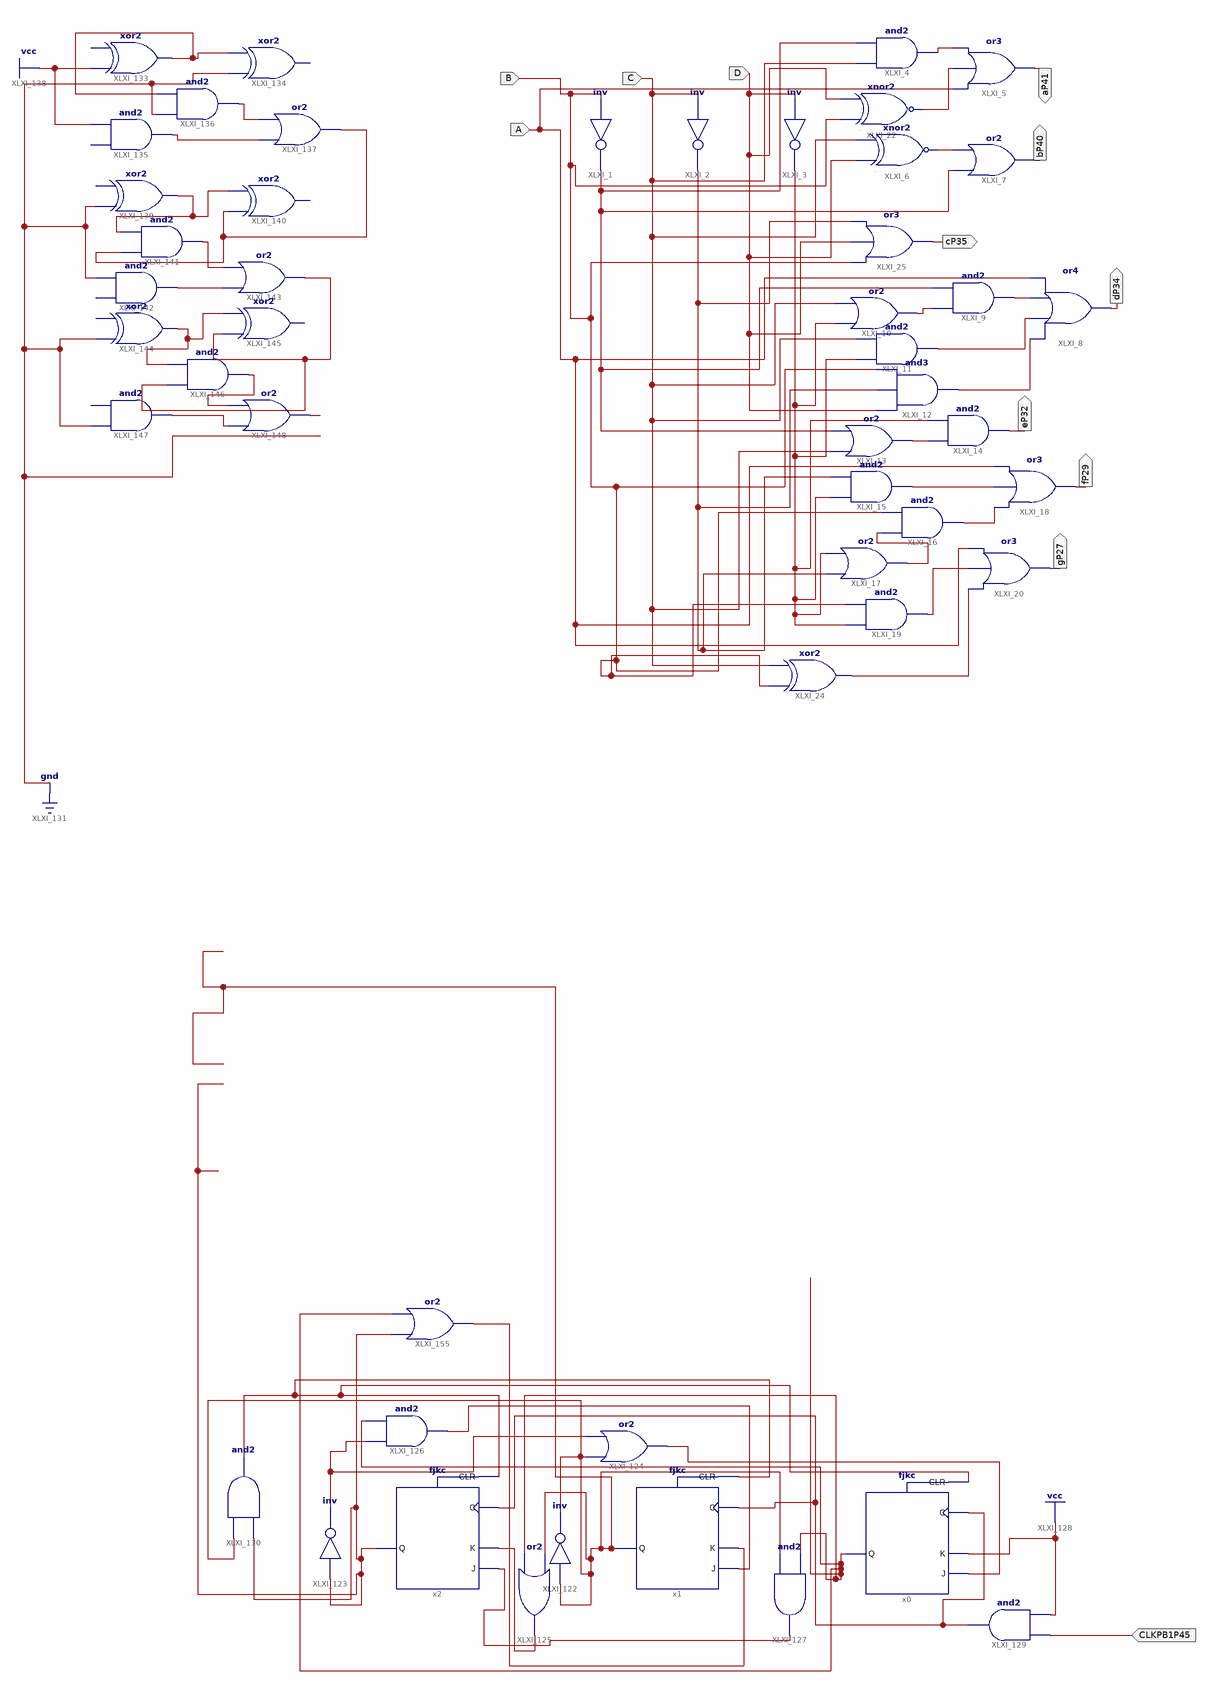
[diagram p0: schematic sheet 1]
// Xilinx ISE schematic lab52sch.sch (spartan6) as structural Verilog: 50 symbols, 12 ports
module lab52sch (
  input  C,
  input  D,
  input  B,
  input  A,
  input  CLKPB1P45,
  output aP41,
  output bP40,
  output cP35,
  output dP34,
  output eP32,
  output fP29,
  output gP27
);

  wire XLXN_4, XLXN_7, XLXN_9, XLXN_13, XLXN_16, XLXN_17, XLXN_21, XLXN_27, XLXN_29, XLXN_36, XLXN_42,
       XLXN_45, XLXN_46, XLXN_49, XLXN_52, XLXN_55, XLXN_238, XLXN_240, XLXN_242, XLXN_248, XLXN_251,
       XLXN_254, XLXN_260, XLXN_266, XLXN_267, XLXN_270, XLXN_274, XLXN_275, XLXN_276, XLXN_278, XLXN_306,
       XLXN_307, XLXN_308, XLXN_309, XLXN_323, XLXN_333, XLXN_334, XLXN_335, XLXN_341;

  not XLXI_1 (XLXN_4, B);
  not XLXI_2 (XLXN_36, C);
  not XLXI_3 (XLXN_17, D);
  and XLXI_4 (XLXN_21, C, XLXN_4);
  or XLXI_5 (aP41, A, XLXN_7, XLXN_21);
  xnor XLXI_6 (XLXN_9, D, C);
  or XLXI_7 (bP40, XLXN_4, XLXN_9);
  or XLXI_8 (dP34, XLXN_13, XLXN_16, XLXN_27, A);
  and XLXI_9 (XLXN_27, XLXN_29, XLXN_4);
  or XLXI_10 (XLXN_29, XLXN_17, C);
  and XLXI_11 (XLXN_16, XLXN_17, C);
  and XLXI_12 (XLXN_13, D, XLXN_36, B);
  or XLXI_13 (XLXN_42, C, XLXN_4);
  and XLXI_14 (eP32, XLXN_42, XLXN_17);
  and XLXI_15 (XLXN_45, XLXN_17, XLXN_36);
  and XLXI_16 (XLXN_46, XLXN_49, B);
  or XLXI_17 (XLXN_49, XLXN_36, XLXN_17);
  or XLXI_18 (fP29, XLXN_46, XLXN_45, A);
  and XLXI_19 (XLXN_52, XLXN_17, B);
  or XLXI_20 (gP27, XLXN_55, XLXN_52, A);
  xor XLXI_24 (XLXN_55, B, C);
  xnor XLXI_22 (XLXN_7, B, D);
  or XLXI_25 (cP35, B, D, XLXN_36);
  buf XLXI_133 (XLXN_270, 1'b1);  // xor2 open: I1
  // xor2 XLXI_134 has open pins: I0=1'b0, I1=XLXN_270, O=open
  buf XLXI_135 (XLXN_266, 1'b1);  // and2 open: I0
  and XLXI_136 (XLXN_267, 1'b0, XLXN_270);
  or XLXI_137 (XLXN_275, XLXN_266, XLXN_267);
  buf XLXI_139 (XLXN_274, 1'b0);  // xor2 open: I1
  // xor2 XLXI_140 has open pins: I0=XLXN_275, I1=XLXN_274, O=open
  and XLXI_141 (XLXN_276, XLXN_275, XLXN_274);
  buf XLXI_142 (XLXN_278, 1'b0);  // and2 open: I0
  or XLXI_143 (XLXN_307, XLXN_278, XLXN_276);
  buf XLXI_144 (XLXN_306, 1'b0);  // xor2 open: I1
  // xor2 XLXI_145 has open pins: I0=XLXN_307, I1=XLXN_306, O=open
  and XLXI_146 (XLXN_308, XLXN_307, XLXN_306);
  buf XLXI_147 (XLXN_309, 1'b0);  // and2 open: I1
  or XLXI_148 (XLXN_323, XLXN_309, XLXN_308);
  or XLXI_125 (XLXN_251, XLXN_334, XLXN_238);
  and XLXI_129 (XLXN_254, 1'b1, CLKPB1P45);
  and XLXI_127 (XLXN_248, XLXN_238, XLXN_334);
  not XLXI_123 (XLXN_240, XLXN_341);
  not XLXI_122 (XLXN_238, XLXN_238);
  fjkc x0 (.C(XLXN_254), .CLR(XLXN_260), .J(XLXN_242), .K(1'b1), .Q(XLXN_334));
  fjkc x1 (.C(XLXN_254), .CLR(XLXN_260), .J(XLXN_333), .K(XLXN_335), .Q(XLXN_238));
  fjkc x2 (.C(XLXN_254), .CLR(XLXN_260), .J(XLXN_248), .K(XLXN_251), .Q(XLXN_341));
  and XLXI_126 (XLXN_333, XLXN_240, XLXN_334);
  or XLXI_155 (XLXN_335, XLXN_341, XLXN_334);
  and XLXI_130 (XLXN_260, XLXN_341, XLXN_238);
  or XLXI_124 (XLXN_242, XLXN_238, XLXN_240);
endmodule
